# EAGLE design miniduino (EAGLE 6.4)
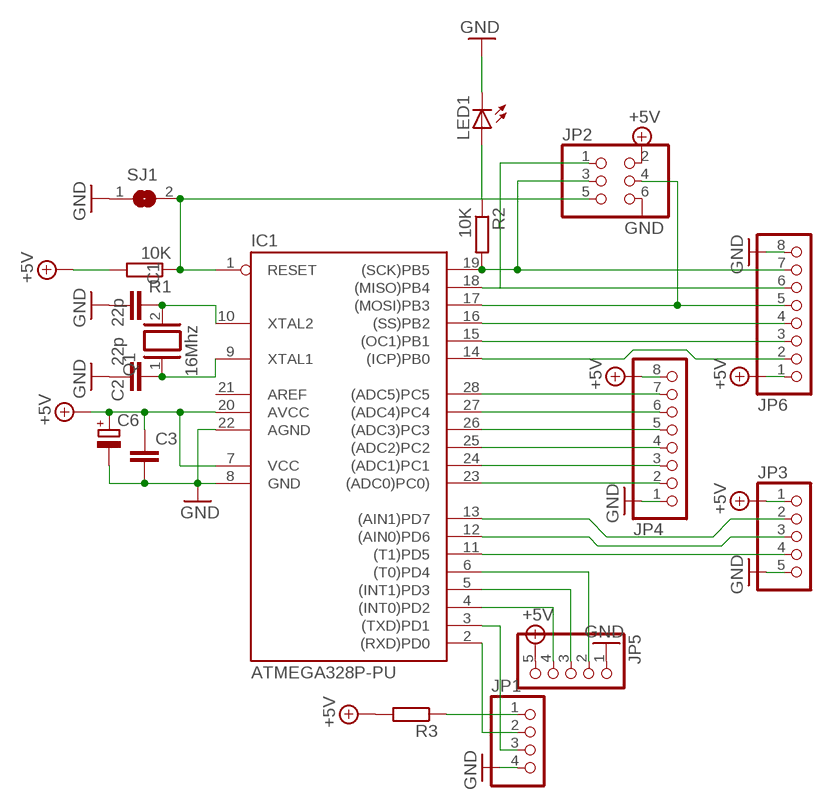
[diagram p0: schematic, sheet 1]

## Parts
C1  22p  C-EU025-024X044  [C025-024X044]
C2  22p  C-EU025-024X044  [C025-024X044]
C3  C-EU050-025X075  [C050-025X075]
C6  CPOL-EUE2.5-5  [E2,5-5]
IC1  ATMEGA328P-PU  [DIL28-3]
JP1  PINHD-1X4  [1X04]
JP2  PINHD-2X3  [2X03]
JP3  PINHD-1X5  [1X05]
JP4  PINHD-1X8  [1X08]
JP5  PINHD-1X5  [1X05]
JP6  PINHD-1X8  [1X08]
LED1  LED3MM  [LED3MM]
Q1  16Mhz  XTAL/S  [QS]
R1  10K  R-EU_0204/2V  [0204V]
R2  10K  R-EU_0204/2V  [0204V]
R3  R-EU_0204/2V  [0204V]
SJ1  SJ  [SJ]

## Nets
+5V: C3.1 C6.+ IC1.7(VCC) IC1.20(AVCC) JP2.2 JP3.1 JP4.8 JP5.5 JP6.1 R1.2 R3.2
GND: C1.2 C2.1 C3.2 C6.- IC1.8(GND) IC1.22(AGND) JP1.4 JP2.6 JP3.5 JP4.1 JP5.1 JP6.8 LED1.K(C) SJ1.1
N$1: C1.1 IC1.10(XTAL2) Q1.2
N$2: IC1.2((RXD)PD0) JP1.2
N$3: IC1.3((TXD)PD1) JP1.3
N$4: C2.2 IC1.9(XTAL1) Q1.1
N$5: IC1.1(RESET) JP2.5 R1.1 SJ1.2
N$6: LED1.A R2.1
N$7: IC1.11((T1)PD5) JP3.4
N$8: IC1.12((AIN0)PD6) JP3.3
N$9: IC1.19((SCK)PB5) JP2.3 JP6.7 R2.2
N$10: IC1.13((AIN1)PD7) JP3.2
N$11: IC1.14((ICP)PB0) JP6.2
N$12: IC1.15((OC1)PB1) JP6.3
N$13: IC1.16((SS)PB2) JP6.4
N$14: IC1.23((ADC0)PC0)) JP4.2
N$15: IC1.24((ADC1)PC1) JP4.3
N$16: IC1.25((ADC2)PC2) JP4.4
N$17: IC1.26((ADC3)PC3) JP4.5
N$18: IC1.27((ADC4)PC4) JP4.6
N$19: IC1.28((ADC5)PC5) JP4.7
N$20: IC1.6((T0)PD4) JP5.2
N$21: IC1.5((INT1)PD3) JP5.3
N$22: IC1.4((INT0)PD2) JP5.4
N$23: JP1.1 R3.1
N$26: IC1.17((MOSI)PB3) JP2.4 JP6.5
N$29: IC1.18((MISO)PB4) JP2.1 JP6.6
Unconnected: IC1.21(AREF)

## Library data of the parts
C1 C2 = resistor:C-EU: CAPACITOR, European symbol
C3 = rcl:C-EU: CAPACITOR, European symbol
C6 = rcl:CPOL-EU: POLARIZED CAPACITOR, European symbol
IC1 = SmartPrj:ATMEGA328P-: MICROCONTROLLER 4 Kbytes FLASH 128 bytes SRAM 256 bytes EEPROM UART 6-channel 10 bit ADC
JP1 = pinhead:PINHD-1X4: PIN HEADER
JP2 = pinhead:PINHD-2X3: PIN HEADER
JP3 JP5 = pinhead:PINHD-1X5: PIN HEADER
JP4 JP6 = pinhead:PINHD-1X8: PIN HEADER
LED1 = led:LED: LED OSRAM: - CHIPLED LG R971, LG N971, LY N971, LG Q971, LY Q971, LO R971, LY R971 LH N974, LH R974 LS Q976, LO Q976, LY Q976 LO Q996 - Hyper CHIPLED LW Q18S LB Q993, LB Q99A, LB R99A - SideLED LS A670, LO A670, LY A670, LG A670, LP A670 LB A673, LV A673, LT A673, LW A673 LH A674 LY A675 LS A676, LA A676, LO A676, LY A676, LW A676 LS A679, LY A679, LG A679 - Hyper Micro SIDELED® LS Y876, LA Y876, LO Y876, LY Y876 LT Y87S - SmartLED LW L88C, LW L88S LB L89C, LB L89S, LG L890 LS L89K, LO L89K, LY L89K LS L896, LA L896, LO L896, LY L896 - TOPLED LS T670, LO T670, LY T670, LG T670, LP T670 LSG T670, LSP T670, LSY T670, LOP T670, LYG T670 LG T671, LOG T671, LSG T671 LB T673, LV T673, LT T673, LW T673 LH T674 LS T676, LA T676, LO T676, LY T676, LB T676, LH T676, LSB T676, LW T676 LB T67C, LV T67C, LT T67C, LS T67K, LO T67K, LY T67K, LW E67C LS E67B, LA E67B, LO E67B, LY E67B, LB E67C, LV E67C, LT E67C LW T67C LS T679, LY T679, LG T679 LS T770, LO T770, LY T770, LG T770, LP T770 LB T773, LV T773, LT T773, LW T773 LH T774 LS E675, LA E675, LY E675, LS T675 LS T776, LA T776, LO T776, LY T776, LB T776 LHGB T686 LT T68C, LB T68C - Hyper Mini TOPLED® LB M676 - Mini TOPLED Santana® LG M470 LS M47K, LO M47K, LY M47K Source: http://www.osram.convergy.de LUXEON: - LUMILED® LXK2-PW12-R00, LXK2-PW12-S00, LXK2-PW14-U00, LXK2-PW14-V00 LXK2-PM12-R00, LXK2-PM12-S00, LXK2-PM14-U00 LXK2-PE12-Q00, LXK2-PE12-R00, LXK2-PE12-S00, LXK2-PE14-T00, LXK2-PE14-U00 LXK2-PB12-K00, LXK2-PB12-L00, LXK2-PB12-M00, LXK2-PB14-N00, LXK2-PB14-P00, LXK2-PB14-Q00 LXK2-PR12-L00, LXK2-PR12-M00, LXK2-PR14-Q00, LXK2-PR14-R00 LXK2-PD12-Q00, LXK2-PD12-R00, LXK2-PD12-S00 LXK2-PH12-R00, LXK2-PH12-S00 LXK2-PL12-P00, LXK2-PL12-Q00, LXK2-PL12-R00 Source: www.luxeon.com KINGBRIGHT: KA-3528ASYC Source: www.kingbright.com
Q1 = special:XTAL/S: CRYSTAL
R1 R2 = resistor:R-EU_: RESISTOR, European symbol
R3 = rcl:R-EU_: RESISTOR, European symbol
SJ1 = jumper:SJ: SMD solder JUMPER

## Board
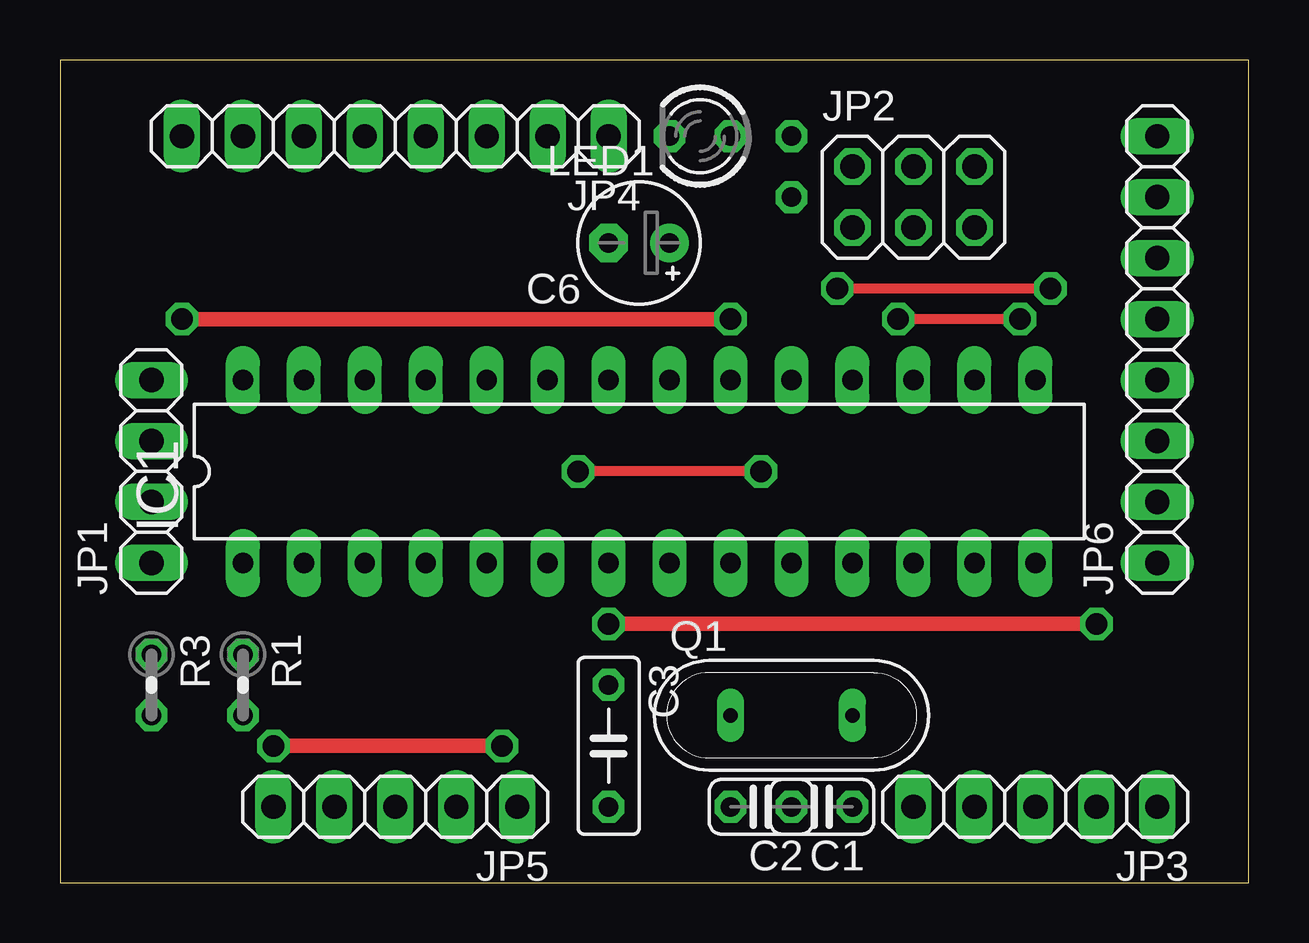
[diagram p1: board, top side]
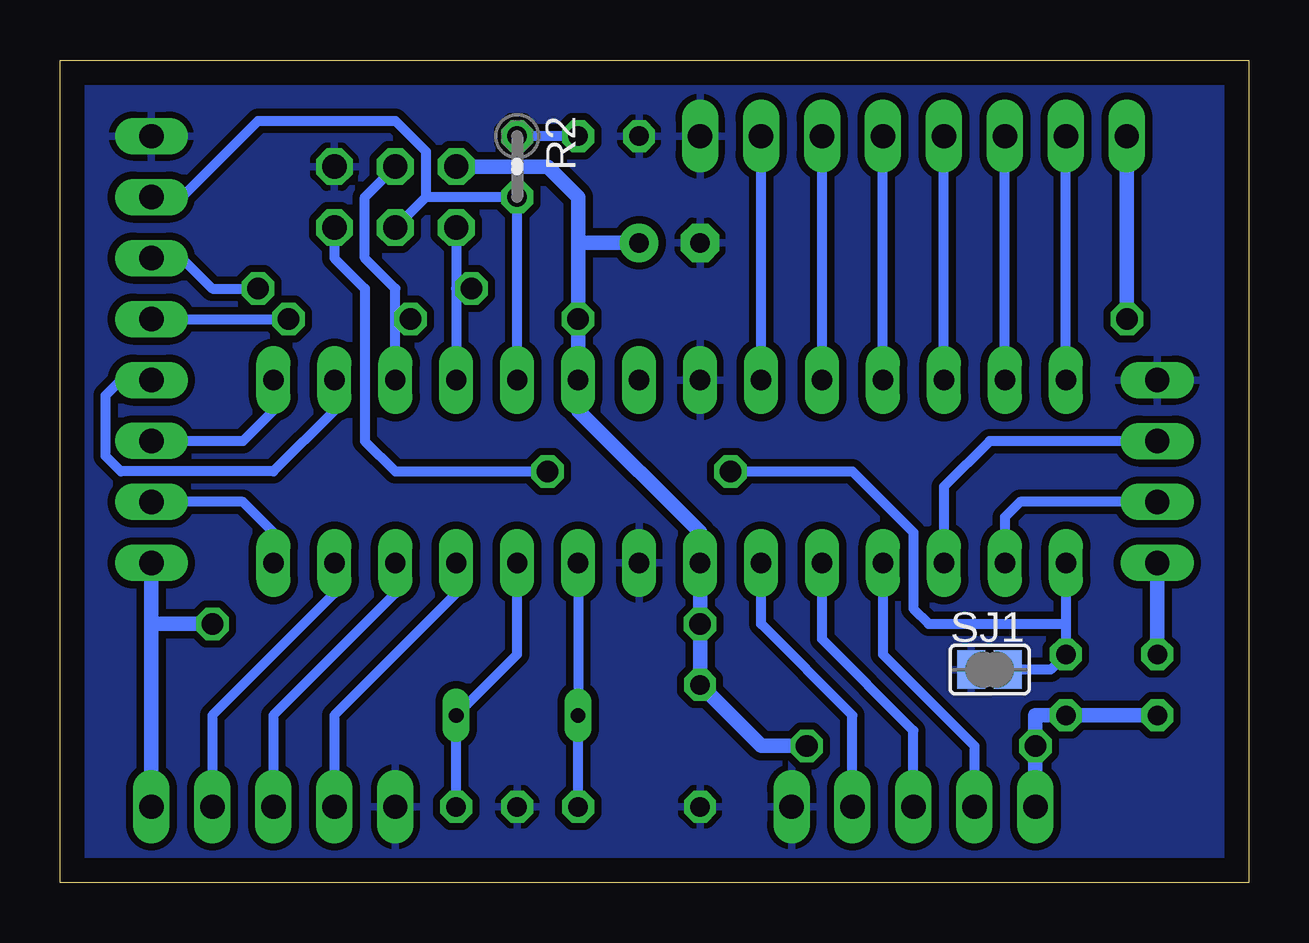
[diagram p2: board, bottom side, seen from below]

Size 49.53 x 34.29 mm. Coordinates in mm from the lower left corner, seen from the top.
Outline: 0,0 49.53,0 49.53,34.29 0,34.29 0,0
Copper layers (1*16): Top 0.035mm / dielectric 1.5mm / Bottom 0.035mm
Design rules "default": minimum track width 10mil, minimum drill 24mil, track to track 8mil, track to pad 8mil, pad to pad 8mil, via to via 8mil, smd to smd 8mil, copper to edge 40mil, drill to drill 8mil, minimum pad ring 10mil, minimum via ring 8mil, stop-mask expansion 4mil, vias tented up to drill 0mil, thermal gap 10mil

### Footprints (pad centres in the part's own frame; a part is rotated, then mirrored left to right if it is on the bottom)
C025-024X044 = drill 0.813 octagon: 1 -1.27,0; 2 1.27,0
C050-025X075 = drill 0.813 octagon: 1 -2.54,0; 2 2.54,0
E2,5-5 = drill 0.813 pad 1.6: + -1.27,0 | drill 0.813 pad 1.6 octagon: - 1.27,0
DIL28-3 = drill 0.85 pad 1.422 long: 1 -16.51,-3.81; 2 -13.97,-3.81; 3 -11.43,-3.81; 4 -8.89,-3.81; 5 -6.35,-3.81; 6 -3.81,-3.81; 7 -1.27,-3.81; 8 1.27,-3.81; 9 3.81,-3.81; 10 6.35,-3.81; 11 8.89,-3.81; 12 11.43,-3.81; 13 13.97,-3.81; 14 16.51,-3.81; 15 16.51,3.81; 16 13.97,3.81; 17 11.43,3.81; 18 8.89,3.81; 19 6.35,3.81; 20 3.81,3.81; 21 1.27,3.81; 22 -1.27,3.81; 23 -3.81,3.81; 24 -6.35,3.81; 25 -8.89,3.81; 26 -11.43,3.81; 27 -13.97,3.81; 28 -16.51,3.81
1X04 = drill 1.016 long: 1 -3.81,0; 2 -1.27,0; 3 1.27,0; 4 3.81,0
2X03 = drill 1.016 octagon: 1 -2.54,-1.27; 2 -2.54,1.27; 3 0,-1.27; 4 0,1.27; 5 2.54,-1.27; 6 2.54,1.27
1X05 = drill 1.016 long: 1 -5.08,0; 2 -2.54,0; 3 0,0; 4 2.54,0; 5 5.08,0
1X08 = drill 1.016 long: 1 -8.89,0; 2 -6.35,0; 3 -3.81,0; 4 -1.27,0; 5 1.27,0; 6 3.81,0; 7 6.35,0; 8 8.89,0
LED3MM = drill 0.813 octagon: A -1.27,0; K 1.27,0
QS = drill 0.61 long: 1 -2.54,0; 2 2.54,0
0204V = drill 0.813 octagon: 1 -1.27,0; 2 1.27,0
SJ = smd 1.168 x 1.6: 1 -0.762,0; 2 0.762,0

### Placement (x,y rotation side)
C1  31.75,3.17 180 top
C2  29.21,3.17 180 top
C3  22.86,5.71 270 top
C6  24.13,26.67 180 top
IC1  24.13,17.14 0 top
JP1  3.81,17.14 90 top
JP2  35.56,28.57 0 top
JP3  40.64,3.17 180 top
JP4  13.97,31.11 180 top
JP5  13.97,3.17 180 top
JP6  45.72,22.23 90 top
LED1  26.67,31.11 180 top
Q1  30.48,6.99 0 top
R1  7.62,8.26 270 top
R2  30.48,29.84 270 bottom
R3  3.81,8.26 270 top
SJ1  10.79,8.89 0 bottom

### Tracks (layer width: path | path; a pad name or v marks a point on that pad's centre or on a via)
+5V  (via drill 0.9)
  Top 0.61: v22.86,10.79 v43.18,10.79 | v18.41,5.71 v8.89,5.71 | v5.08,23.5 v27.94,23.5
  Bottom 0.61: JP2.2 29.21,29.84 27.94,28.57 27.94,26.67 | R3.2 R1.2 8.89,6.99 v8.89,5.71 JP5.5 | JP3.1 45.72,10.79 | 45.72,10.79 JP6.1 | v43.18,10.79 45.72,10.79 | JP4.8 v5.08,23.5 | v18.41,5.71 20.32,5.71 C3.1 v22.86,10.79 IC1.7 22.86,14.61 27.94,19.68 IC1.20 v27.94,23.5 27.94,26.67 | C6.+ 27.94,26.67
GND
  pour Bottom (isolate 0.305): 0,34.29 49.53,34.29 49.53,0 0,0
N$1
  Bottom 0.406: IC1.10 30.48,9.53 Q1.2 C1.1
N$2
  Bottom 0.406: JP1.2 9.53,15.88 10.16,15.24 IC1.2
N$3
  Bottom 0.406: IC1.3 12.7,16.51 10.79,18.41 JP1.3
N$4
  Bottom 0.406: IC1.9 Q1.1 C2.2
N$5  (via drill 0.9)
  Top 0.406: v29.21,17.14 v21.59,17.14
  Bottom 0.406: IC1.1 7.62,10.79 | 7.62,10.79 R1.1 8.26,8.89 SJ1.2 | JP2.5 38.1,26.04 36.83,24.77 36.83,18.41 35.56,17.14 v29.21,17.14 | v21.59,17.14 16.51,17.14 13.97,14.61 13.97,11.43 13.34,10.79 7.62,10.79
N$6
  Bottom 0.406: LED1.A R2.1
N$7
  Bottom 0.406: IC1.11 33.02,12.06 38.1,6.99 JP3.4
N$8
  Bottom 0.406: IC1.12 35.56,12.06 40.64,6.99 JP3.3
N$9
  Bottom 0.406: IC1.19 R2.2 34.29,28.57 | 34.29,28.57 JP2.3 | JP6.7 44.45,28.57 41.27,31.75 35.56,31.75 34.29,30.48 34.29,28.57
N$10
  Bottom 0.406: IC1.13 38.1,12.06 43.18,6.99 JP3.2
N$11
  Bottom 0.406: IC1.14 40.64,14.61 41.91,15.88 JP6.2
N$12
  Bottom 0.406: IC1.15 40.64,19.68 41.91,18.41 JP6.3
N$13
  Bottom 0.406: IC1.16 38.1,19.68 40.64,17.14 46.99,17.14 47.62,17.78 47.62,20.32 46.99,20.95 JP6.4
N$14
  Bottom 0.406: IC1.23 JP4.2
N$15
  Bottom 0.406: IC1.24 JP4.3
N$16
  Bottom 0.406: IC1.25 JP4.4
N$17
  Bottom 0.406: IC1.26 JP4.5
N$18
  Bottom 0.406: IC1.27 JP4.6
N$19
  Bottom 0.406: IC1.28 JP4.7
N$20
  Bottom 0.406: JP5.2 16.51,6.99 20.32,10.79 IC1.6
N$21
  Bottom 0.406: JP5.3 13.97,6.35 17.78,10.16 IC1.5
N$22
  Bottom 0.406: IC1.4 15.24,9.53 11.43,5.71 JP5.4
N$23
  Bottom 0.61: JP1.1 R3.1
N$26  (via drill 0.9)
  Top 0.406: v40.01,23.5 v34.92,23.5
  Bottom 0.406: IC1.17 35.56,23.5 | 35.56,23.5 35.56,24.77 36.83,26.04 36.83,28.57 JP2.4 | JP6.5 v40.01,23.5 | v34.92,23.5 35.56,23.5
N$29  (via drill 0.9)
  Top 0.406: v41.27,24.77 v32.38,24.77
  Bottom 0.406: JP6.6 44.45,26.04 43.18,24.77 v41.27,24.77 | JP2.1 33.02,24.77 | 33.02,24.77 IC1.18 | v32.38,24.77 33.02,24.77